# Altium schematic sheet Prelim Design.SchDoc
size A; SheetNumber: 1; SheetTotal: 1
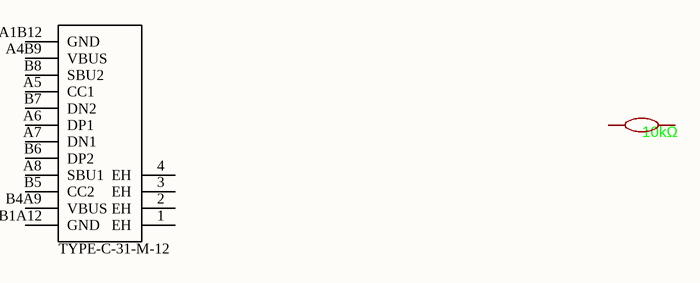
[diagram p0: Prelim Design.SchDoc]

## Parts
R?  10kΩ  [R0603]
USBC  TYPE-C-31-M-12  [USB-C_SMD-TYPE-C-31-M-12_1]

## Nets

Not connected (* = marked no-connect by the designer): R? 1 2; USBC 1(EH) 2(EH) 3(EH) 4(EH) A1B12(GND) A4B9(VBUS) A5(CC1) A6(DP1) A7(DN1) A8(SBU1) B1A12(GND) B4A9(VBUS) B5(CC2) B6(DP2) B7(DN2) B8(SBU2)

## Library data of the parts
R? = 0603WAF1002T5E: Type:Thick Film Resistor Resistance:10kΩ Tolerance:±1% Tolerance:±1% Power(Watts):100mW Voltage-Supply(Max):75V Temperature Coefficient:±100ppm/℃ Temperature Coefficient:±100ppm/℃ Operating Temperature:-55℃~+155℃ Operating Temperature:-55℃~+155℃; Manufacturer: UNI-ROYAL(厚声); AddInBom: yes; ModelId: 112863783b5b41f1b5254f87eedc7932ÂŽ0819f05c4eef4c71ace90d822a990e87; ModelTransform: 31.8897,63.7794,0,90,0,0,0,0,0; Tolerance: ±1%; Power(Watts): 100mW; Voltage-Supply(Max): 75V; Symbol: 0603WAF1002T5E; Device: 0603WAF1002T5E; LCSC Part Name: 厚膜电阻 10kΩ ±1% 100mW; SupplierPart: C25804; ManufacturerPart: 0603WAF1002T5E; Supplier Footprint: 0603; JLCPCB Part Class: Basic Part; Datasheet: https://item.szlcsc.com/datasheet/0603WAF1002T5E/26547.html; Supplier: LCSC; ConvertToPcb: yes; FootprintName: R0603; ModelName: R0603; Type: Thick Film Resistor; Value: 10kΩ; Temperature Coefficient: ±100ppm/℃; Operating Temperature: -55℃~+155℃
USBC = TYPE-C-31-M-12: USB-C (USB TYPE-C) Receptacle Connector 16 Position Surface Mount